# Altium schematic sheet S7CAS-PLEIADES-CARTE-MERE_P02_FPGA_B4B5.SchDoc
size Tabloid; DocumentNumber: 7; SheetNumber: 7; SheetTotal: 14; Size: 11x17; Sheet_Name: FPGA Bank4-5
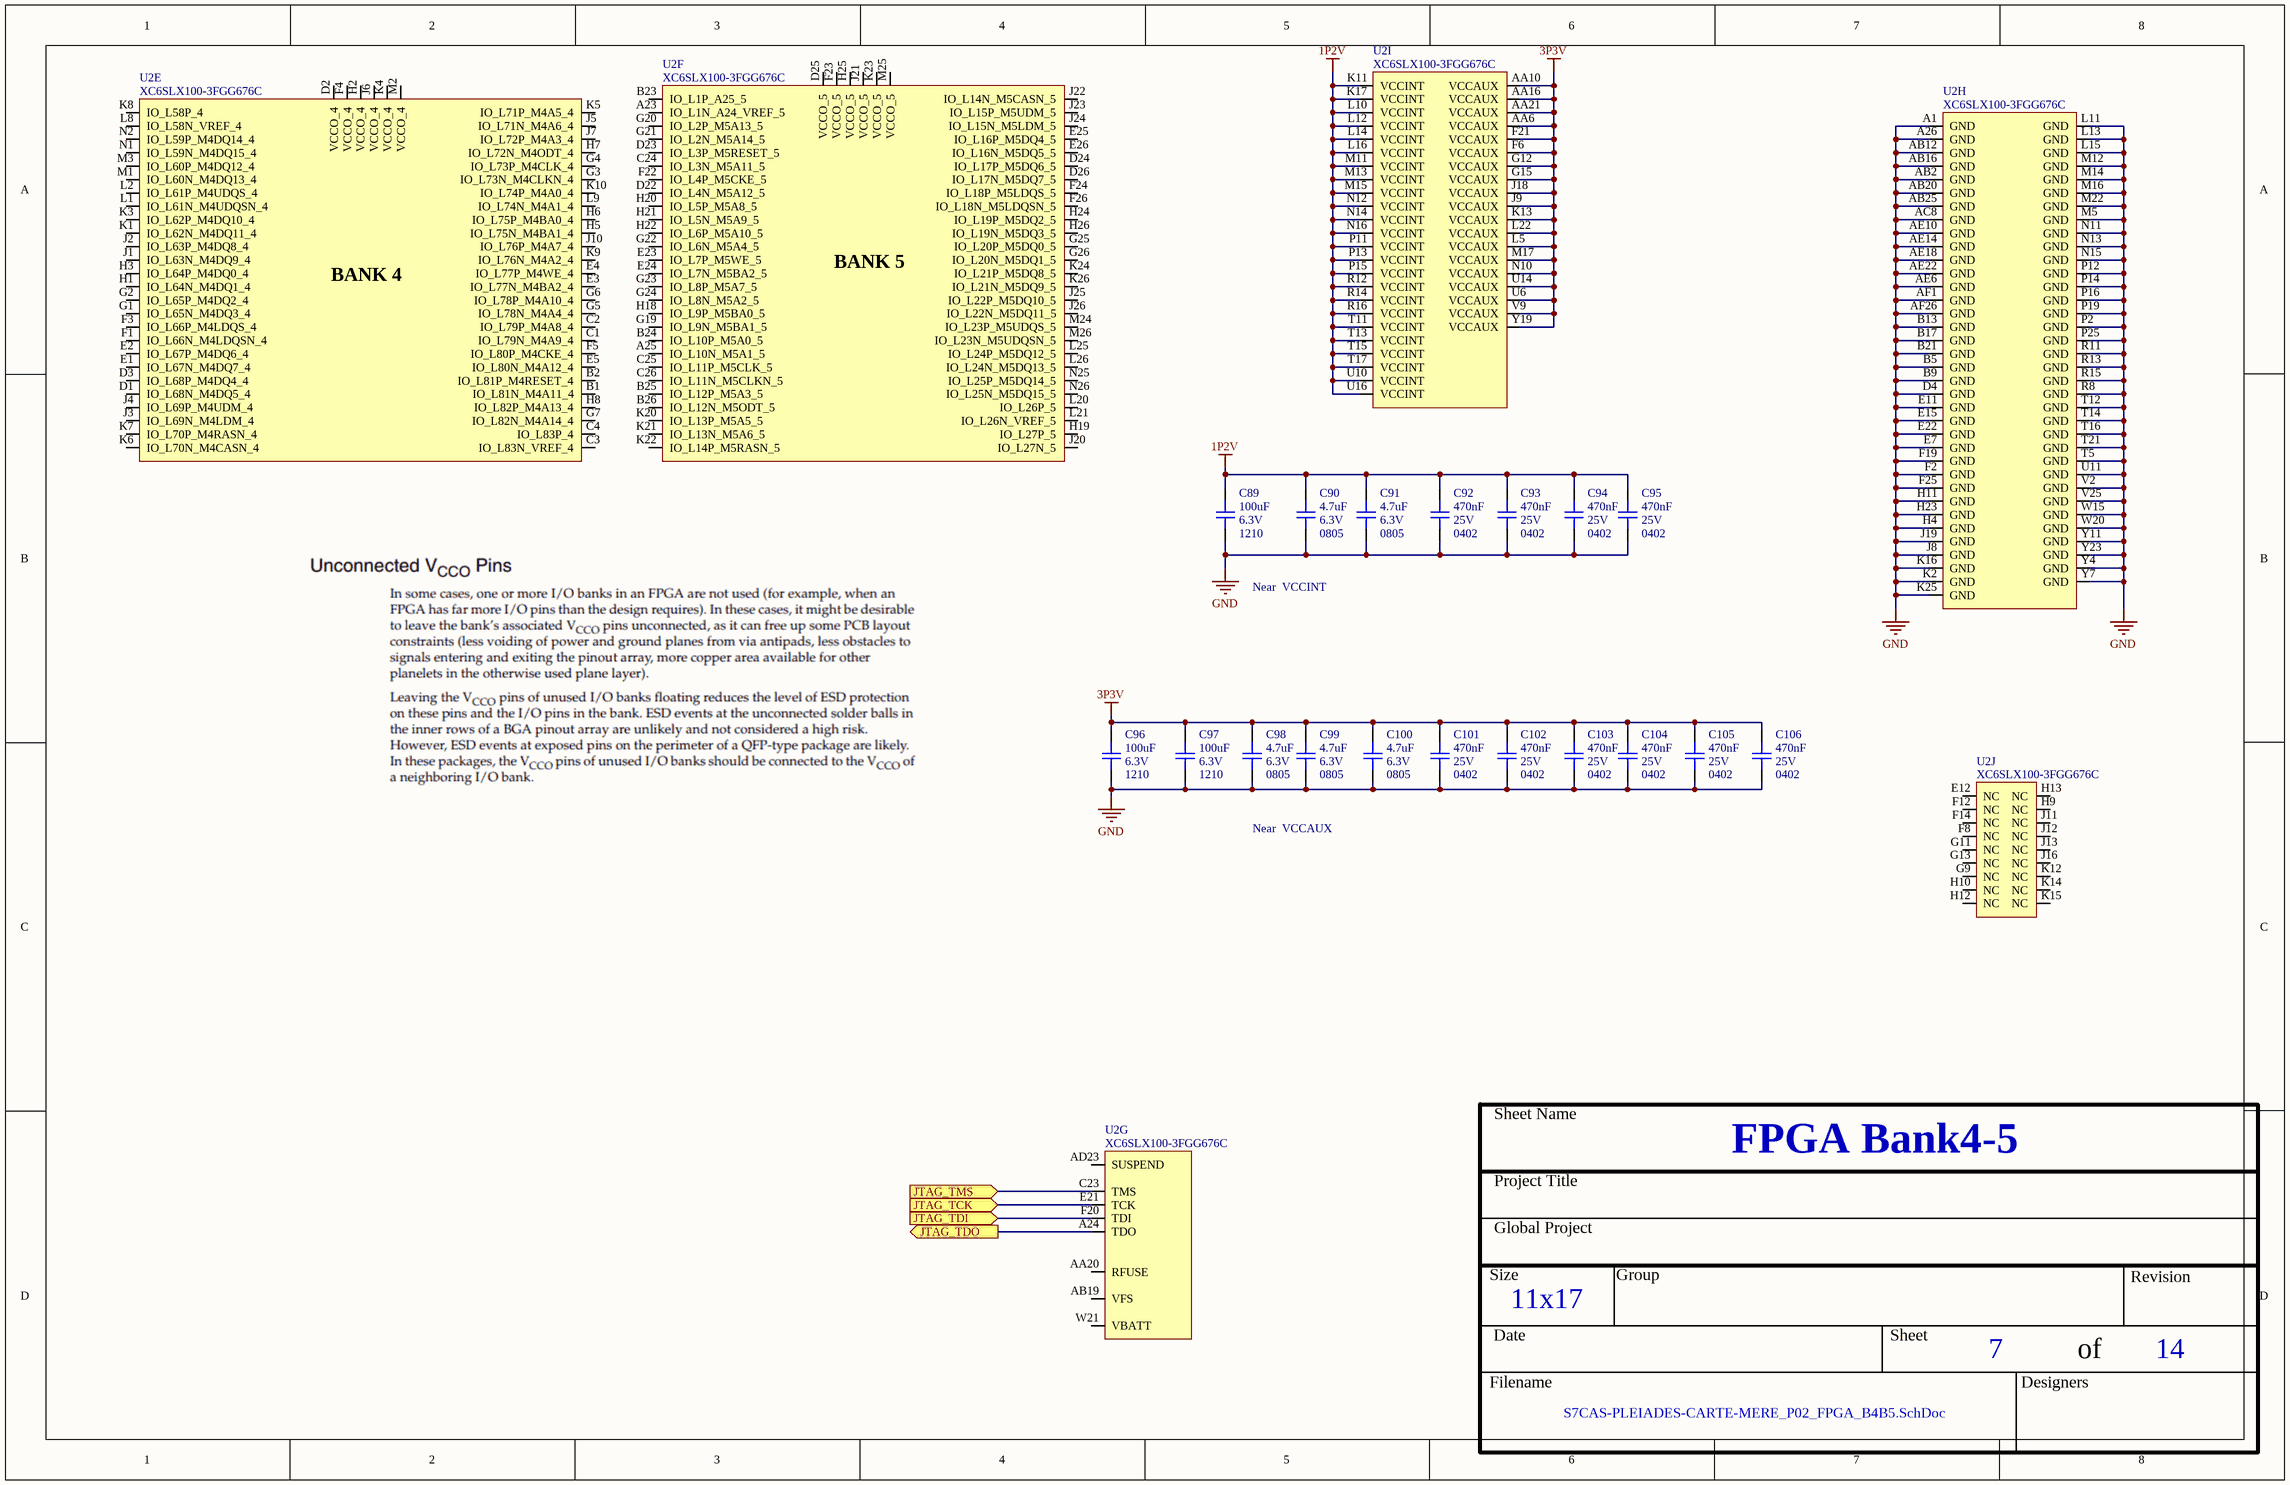
[diagram p0: S7CAS-PLEIADES-CARTE-MERE_P02_FPGA_B4B5.SchDoc]

## Parts
C89  value 100uF  Voltage: 6.3V  Package: 1210  [CAP_1210]  (hidden comment: CAP - 1210)
C90  value 4.7uF  Voltage: 6.3V  Package: 0805  [CAP_0805]  (hidden comment: CAP - 0805)
C91  value 4.7uF  Voltage: 6.3V  Package: 0805  [CAP_0805]  (hidden comment: CAP - 0805)
C92  value 470nF  Voltage: 25V  Package: 0402  [CAP_0402]  (hidden comment: CAP - 0402)
C93  value 470nF  Voltage: 25V  Package: 0402  [CAP_0402]  (hidden comment: CAP - 0402)
C94  value 470nF  Voltage: 25V  Package: 0402  [CAP_0402]  (hidden comment: CAP - 0402)
C95  value 470nF  Voltage: 25V  Package: 0402  [CAP_0402]  (hidden comment: CAP - 0402)
C96  value 100uF  Voltage: 6.3V  Package: 1210  [CAP_1210]  (hidden comment: CAP - 1210)
C97  value 100uF  Voltage: 6.3V  Package: 1210  [CAP_1210]  (hidden comment: CAP - 1210)
C98  value 4.7uF  Voltage: 6.3V  Package: 0805  [CAP_0805]  (hidden comment: CAP - 0805)
C99  value 4.7uF  Voltage: 6.3V  Package: 0805  [CAP_0805]  (hidden comment: CAP - 0805)
C100  value 4.7uF  Voltage: 6.3V  Package: 0805  [CAP_0805]  (hidden comment: CAP - 0805)
C101  value 470nF  Voltage: 25V  Package: 0402  [CAP_0402]  (hidden comment: CAP - 0402)
C102  value 470nF  Voltage: 25V  Package: 0402  [CAP_0402]  (hidden comment: CAP - 0402)
C103  value 470nF  Voltage: 25V  Package: 0402  [CAP_0402]  (hidden comment: CAP - 0402)
C104  value 470nF  Voltage: 25V  Package: 0402  [CAP_0402]  (hidden comment: CAP - 0402)
C105  value 470nF  Voltage: 25V  Package: 0402  [CAP_0402]  (hidden comment: CAP - 0402)
C106  value 470nF  Voltage: 25V  Package: 0402  [CAP_0402]  (hidden comment: CAP - 0402)
U2  XC6SLX100-3FGG676C  [FPGA_XILINX_FGG676]  (parts E,F,G,H,I,J of 10)

## Ports
JTAG_TCK (in), JTAG_TDI (in), JTAG_TDO (out), JTAG_TMS (in)

## Nets
1P2V: C89.2 C90.2 C91.2 C92.2 C93.2 C94.2 C95.2 U2.K11(VCCINT) U2.K17(VCCINT) U2.L10(VCCINT) U2.L12(VCCINT) U2.L14(VCCINT) U2.L16(VCCINT) U2.M11(VCCINT) U2.M13(VCCINT) U2.M15(VCCINT) U2.N12(VCCINT) U2.N14(VCCINT) U2.N16(VCCINT) U2.P11(VCCINT) U2.P13(VCCINT) U2.P15(VCCINT) U2.R12(VCCINT) U2.R14(VCCINT) U2.R16(VCCINT) U2.T11(VCCINT) U2.T13(VCCINT) U2.T15(VCCINT) U2.T17(VCCINT) U2.U10(VCCINT) U2.U16(VCCINT)
3P3V: C96.2 C97.2 C98.2 C99.2 C100.2 C101.2 C102.2 C103.2 C104.2 C105.2 C106.2 U2.AA6(VCCAUX) U2.AA10(VCCAUX) U2.AA16(VCCAUX) U2.AA21(VCCAUX) U2.F6(VCCAUX) U2.F21(VCCAUX) U2.G12(VCCAUX) U2.G15(VCCAUX) U2.J9(VCCAUX) U2.J18(VCCAUX) U2.K13(VCCAUX) U2.L5(VCCAUX) U2.L22(VCCAUX) U2.M17(VCCAUX) U2.N10(VCCAUX) U2.U6(VCCAUX) U2.U14(VCCAUX) U2.V9(VCCAUX) U2.Y19(VCCAUX)
GND: C89.1 C90.1 C91.1 C92.1 C93.1 C94.1 C95.1 C96.1 C97.1 C98.1 C99.1 C100.1 C101.1 C102.1 C103.1 C104.1 C105.1 C106.1 U2.A1(GND) U2.A26(GND) U2.AB2(GND) U2.AB12(GND) U2.AB16(GND) U2.AB20(GND) U2.AB25(GND) U2.AC8(GND) U2.AE6(GND) U2.AE10(GND) U2.AE14(GND) U2.AE18(GND) U2.AE22(GND) U2.AF1(GND) U2.AF26(GND) U2.B5(GND) U2.B9(GND) U2.B13(GND) U2.B17(GND) U2.B21(GND) U2.D4(GND) U2.E7(GND) U2.E11(GND) U2.E15(GND) U2.E22(GND) U2.F2(GND) U2.F19(GND) U2.F25(GND) U2.H4(GND) U2.H11(GND) U2.H23(GND) U2.J8(GND) U2.J19(GND) U2.K2(GND) U2.K16(GND) U2.K25(GND) U2.L11(GND) U2.L13(GND) U2.L15(GND) U2.M5(GND) U2.M12(GND) U2.M14(GND) U2.M16(GND) U2.M22(GND) U2.N11(GND) U2.N13(GND) U2.N15(GND) U2.P2(GND) U2.P12(GND) U2.P14(GND) U2.P16(GND) U2.P19(GND) U2.P25(GND) U2.R8(GND) U2.R11(GND) U2.R13(GND) U2.R15(GND) U2.T5(GND) U2.T12(GND) U2.T14(GND) U2.T16(GND) U2.T21(GND) U2.U11(GND) U2.V2(GND) U2.V25(GND) U2.W15(GND) U2.W20(GND) U2.Y4(GND) U2.Y7(GND) U2.Y11(GND) U2.Y23(GND)
JTAG_TCK: U2.E21(TCK) ; port JTAG_TCK
JTAG_TDI: U2.F20(TDI) ; port JTAG_TDI
JTAG_TDO: U2.A24(TDO) ; port JTAG_TDO
JTAG_TMS: U2.C23(TMS) ; port JTAG_TMS

Not connected (* = marked no-connect by the designer): U2 A23(IO_L1N_A24_VREF_5) A25(IO_L10N_M5A1_5) AA20(RFUSE) AB19(VFS) AD23(SUSPEND) B1(IO_L81N_M4A11_4) B2(IO_L81P_M4RESET_4) B23(IO_L1P_A25_5) B24(IO_L10P_M5A0_5) B25(IO_L12P_M5A3_5) B26(IO_L12N_M5ODT_5) C1(IO_L79N_M4A9_4) C2(IO_L79P_M4A8_4) C3(IO_L83N_VREF_4) C4(IO_L83P_4) C24(IO_L3N_M5A11_5) C25(IO_L11P_M5CLK_5) C26(IO_L11N_M5CLKN_5) D1(IO_L68N_M4DQ5_4) D2(VCCO_4) D3(IO_L68P_M4DQ4_4) D22(IO_L4N_M5A12_5) D23(IO_L3P_M5RESET_5) D24(IO_L17P_M5DQ6_5) D25(VCCO_5) D26(IO_L17N_M5DQ7_5) E1(IO_L67N_M4DQ7_4) E2(IO_L67P_M4DQ6_4) E3(IO_L77N_M4BA2_4) E4(IO_L77P_M4WE_4) E5(IO_L80N_M4A12_4) E12(NC) E23(IO_L7P_M5WE_5) E24(IO_L7N_M5BA2_5) E25(IO_L16P_M5DQ4_5) E26(IO_L16N_M5DQ5_5) F1(IO_L66N_M4LDQSN_4) F3(IO_L66P_M4LDQS_4) F4(VCCO_4) F5(IO_L80P_M4CKE_4) F8(NC) F12(NC) F14(NC) F22(IO_L4P_M5CKE_5) F23(VCCO_5) F24(IO_L18P_M5LDQS_5) F26(IO_L18N_M5LDQSN_5) G1(IO_L65N_M4DQ3_4) G2(IO_L65P_M4DQ2_4) G3(IO_L73N_M4CLKN_4) G4(IO_L73P_M4CLK_4) G5(IO_L78N_M4A4_4) G6(IO_L78P_M4A10_4) G7(IO_L82N_M4A14_4) G9(NC) G11(NC) G13(NC) G19(IO_L9N_M5BA1_5) G20(IO_L2P_M5A13_5) G21(IO_L2N_M5A14_5) G22(IO_L6N_M5A4_5) G23(IO_L8P_M5A7_5) G24(IO_L8N_M5A2_5) G25(IO_L20P_M5DQ0_5) G26(IO_L20N_M5DQ1_5) H1(IO_L64N_M4DQ1_4) H2(VCCO_4) H3(IO_L64P_M4DQ0_4) H5(IO_L75N_M4BA1_4) H6(IO_L75P_M4BA0_4) H7(IO_L72N_M4ODT_4) H8(IO_L82P_M4A13_4) H9(NC) H10(NC) H12(NC) H13(NC) H18(IO_L9P_M5BA0_5) H19(IO_L27P_5) H20(IO_L5P_M5A8_5) H21(IO_L5N_M5A9_5) H22(IO_L6P_M5A10_5) H24(IO_L19P_M5DQ2_5) H25(VCCO_5) H26(IO_L19N_M5DQ3_5) J1(IO_L63N_M4DQ9_4) J2(IO_L63P_M4DQ8_4) J3(IO_L69N_M4LDM_4) J4(IO_L69P_M4UDM_4) J5(IO_L71N_M4A6_4) J6(VCCO_4) J7(IO_L72P_M4A3_4) J10(IO_L76P_M4A7_4) J11(NC) J12(NC) J13(NC) J16(NC) J20(IO_L27N_5) J21(VCCO_5) J22(IO_L14N_M5CASN_5) J23(IO_L15P_M5UDM_5) J24(IO_L15N_M5LDM_5) J25(IO_L22P_M5DQ10_5) J26(IO_L22N_M5DQ11_5) K1(IO_L62N_M4DQ11_4) K3(IO_L62P_M4DQ10_4) K4(VCCO_4) K5(IO_L71P_M4A5_4) K6(IO_L70N_M4CASN_4) K7(IO_L70P_M4RASN_4) K8(IO_L58P_4) K9(IO_L76N_M4A2_4) K10(IO_L74P_M4A0_4) K12(NC) K14(NC) K15(NC) K20(IO_L13P_M5A5_5) K21(IO_L13N_M5A6_5) K22(IO_L14P_M5RASN_5) K23(VCCO_5) K24(IO_L21P_M5DQ8_5) K26(IO_L21N_M5DQ9_5) L1(IO_L61N_M4UDQSN_4) L2(IO_L61P_M4UDQS_4) L8(IO_L58N_VREF_4) L9(IO_L74N_M4A1_4) L20(IO_L26P_5) L21(IO_L26N_VREF_5) L25(IO_L24P_M5DQ12_5) L26(IO_L24N_M5DQ13_5) M1(IO_L60N_M4DQ13_4) M2(VCCO_4) M3(IO_L60P_M4DQ12_4) M24(IO_L23P_M5UDQS_5) M25(VCCO_5) M26(IO_L23N_M5UDQSN_5) N1(IO_L59N_M4DQ15_4) N2(IO_L59P_M4DQ14_4) N25(IO_L25P_M5DQ14_5) N26(IO_L25N_M5DQ15_5) W21(VBATT)

## Notes on the sheet
- Near  VCCINT
- Near  VCCAUX
- Sheet Name
- Project Title
- Global Project
- Size
- Group
- Revision
- Date
- Sheet
- of
- Filename
- Designers
- (in symbol FPGA_XC6SLX100-3FGG676C, part E) BANK 4
- (in symbol FPGA_XC6SLX100-3FGG676C, part F) BANK 5

## Library data of the parts
C89 C96 C97 = CAP - 1210: Precision: 10%; Current: *; CreatedBy: Jonathan Bouchard; Power: *
C90 C91 C98-C100 = CAP - 0805: Precision: 10%; Current: *; CreatedBy: Jonathan Bouchard; Power: *
C92-C95 C101-C106 = CAP - 0402: Precision: 10%; Current: *; CreatedBy: Jonathan Bouchard; Power: *
U2 = FPGA_XC6SLX100-3FGG676C: FPGA - XILINX SPARTAN 6 480 I/O - BGA-676; Voltage: 1.14 V ~ 1.26 V; Current: *; Power: *; Mfg: Xilinx; Mfg Part Number: XC6SLX100-3FGG676C; HelpURL: https://www.xilinx.com/support/documentation/data_sheets/ds162.pdf; CreatedBy: Jonathan Bouchard; Temperature: 0°C ~ 85°C (TJ); Value: *; Precision: *; Package: BGA-676; Supplier 1: Digikey; Supplier Part Number 1: 122-1760-ND